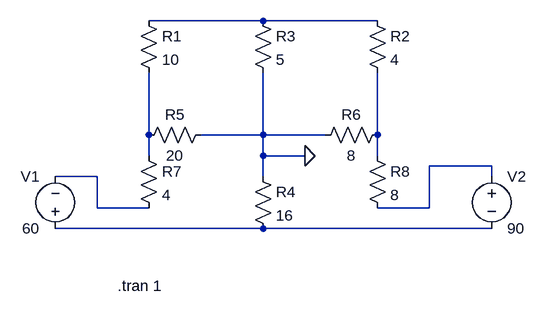
[diagram p0: schematic Ex_03_79.asc]
Ex_03_79.asc, the LTspice schematic file:
Version 4.1
SHEET 1 880 680
WIRE 160 -32 -16 -32
WIRE 336 -32 160 -32
WIRE -16 144 -16 48
WIRE 160 144 160 48
WIRE 160 144 64 144
WIRE 256 144 160 144
WIRE 336 144 336 48
WIRE -16 176 -16 144
WIRE 160 176 160 144
WIRE 224 176 160 176
WIRE 336 176 336 144
WIRE 512 192 416 192
WIRE -96 208 -160 208
WIRE 160 208 160 176
WIRE 512 208 512 192
WIRE -96 256 -96 208
WIRE -16 256 -96 256
WIRE 416 256 416 192
WIRE 416 256 336 256
WIRE 160 288 -160 288
WIRE 512 288 160 288
FLAG 224 176 0
SYMBOL voltage -160 304 R180
WINDOW 0 24 96 Left 2
WINDOW 3 24 16 Left 2
WINDOW 123 0 0 Left 0
WINDOW 39 0 0 Left 0
SYMATTR InstName V1
SYMATTR Value 60
SYMBOL voltage 512 192 R0
WINDOW 123 0 0 Left 0
WINDOW 39 0 0 Left 0
SYMATTR InstName V2
SYMATTR Value 90
SYMBOL res -32 -48 R0
SYMATTR InstName R1
SYMATTR Value 10
SYMBOL res 320 -48 R0
SYMATTR InstName R2
SYMATTR Value 4
SYMBOL res 144 -48 R0
SYMATTR InstName R3
SYMATTR Value 5
SYMBOL res 144 192 R0
SYMATTR InstName R4
SYMATTR Value 16
SYMBOL res 80 128 R90
WINDOW 0 0 56 VBottom 2
WINDOW 3 32 56 VTop 2
SYMATTR InstName R5
SYMATTR Value 20
SYMBOL res 352 128 R90
WINDOW 0 0 56 VBottom 2
WINDOW 3 32 56 VTop 2
SYMATTR InstName R6
SYMATTR Value 8
SYMBOL res -32 160 R0
SYMATTR InstName R7
SYMATTR Value 4
SYMBOL res 320 160 R0
SYMATTR InstName R8
SYMATTR Value 8
TEXT -64 376 Left 2 !.tran 1

The netlist it stands for:
* Ex_03_79.asc
V1 N006 N005 60
V2 N004 N006 90
R1 N001 N002 10
R2 N001 N003 4
R3 N001 0 5
R4 0 N006 16
R5 0 N002 20
R6 N003 0 8
R7 N002 N005 4
R8 N003 N004 8
.tran 1
.backanno
.end